# EAGLE design oledSpi (EAGLE 5.08)
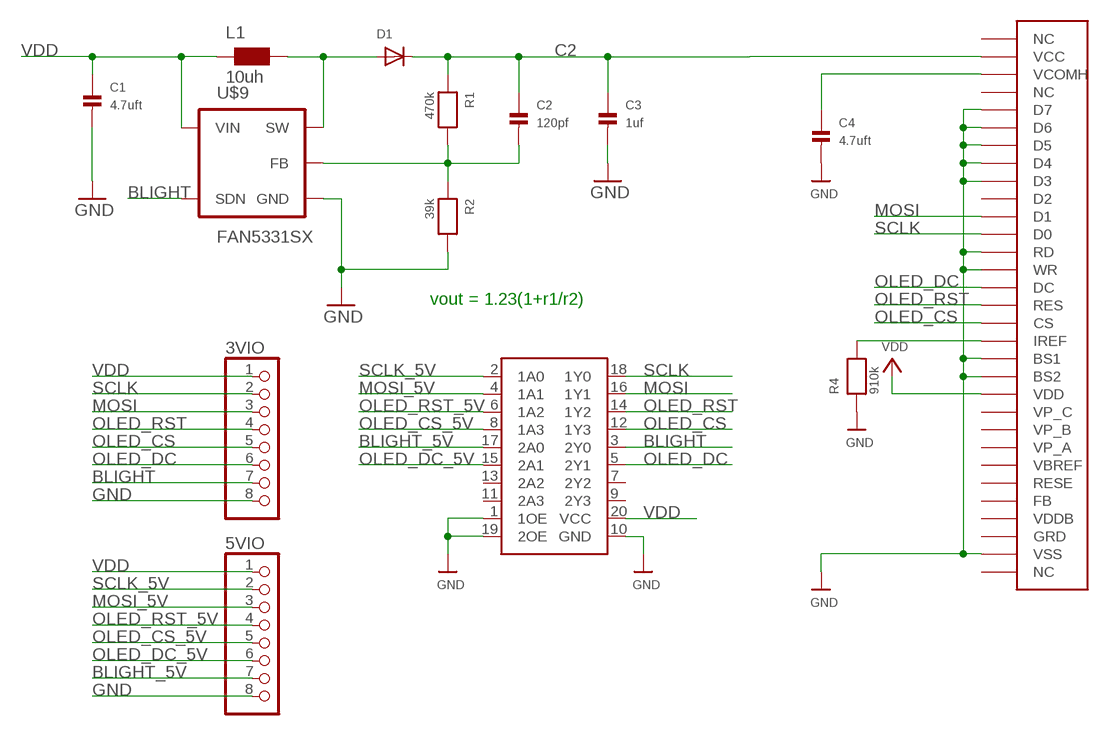
[diagram p0: schematic, sheet 1]

## Parts
3VIO  HEADER-1X8ROUND  [1X08_ROUND]
5VIO  HEADER-1X8ROUND  [1X08_ROUND]
C1  4.7uft  CAP_CERAMIC0805  [0805]
C2  120pf  CAP_CERAMIC0805  [0805]
C3  1uf  CAP_CERAMIC0805  [0805]
C4  4.7uft  CAP_CERAMIC0805  [0805]
D1  DIODESOD-123  [SOD-123]
L1  10uh  WE-KIHQ_1008  [WE-KI_1008_B]
R1  470k  RESISTOR0805  [0805]
R2  39k  RESISTOR0805  [0805]
R4  910k  RESISTOR0805  [0805]
U$1  OLED1040.8MM  [SSD1332OLED_08]
U$2  74LVC244  [TSSOP20]
U$9  FAN5331SX  [SOT23-5]

## Nets
BLIGHT: 3VIO.7 U$2.3(2Y0) U$9.5(SDN)
BLIGHT_5V: 5VIO.7 U$2.17(2A0)
C2 [power]: C2.1 C3.1 D1.C R1.1 U$1.P$2(VCC)
GND [power]: 3VIO.8 5VIO.8 C1.2 C3.2 C4.2 R2.2 R4.1 U$1.P$5(D7) U$1.P$6(D6) U$1.P$7(D5) U$1.P$8(D4) U$1.P$9(D3) U$1.P$13(RD) U$1.P$14(WR) U$1.P$19(BS1) U$1.P$20(BS2) U$1.P$30(VSS) U$2.1(1OE) U$2.10(GND) U$2.19(2OE) U$9.2(GND)
MOSI: 3VIO.3 U$1.P$11(D1) U$2.16(1Y1)
MOSI_5V: 5VIO.3 U$2.4(1A1)
N$1: D1.A L1.1 U$9.1(SW)
N$5: C2.2 R1.2 R2.1 U$9.3(FB)
N$7: C4.1 U$1.P$3(VCOMH)
N$9: R4.2 U$1.P$18(IREF)
OLED_CS: 3VIO.5 U$1.P$17(CS) U$2.12(1Y3)
OLED_CS_5V: 5VIO.5 U$2.8(1A3)
OLED_DC: 3VIO.6 U$1.P$15(DC) U$2.5(2Y1)
OLED_DC_5V: 5VIO.6 U$2.15(2A1)
OLED_RST: 3VIO.4 U$1.P$16(RES) U$2.14(1Y2)
OLED_RST_5V: 5VIO.4 U$2.6(1A2)
SCLK: 3VIO.2 U$1.P$12(D0) U$2.18(1Y0)
SCLK_5V: 5VIO.2 U$2.2(1A0)
VDD [power]: 3VIO.1 5VIO.1 C1.1 L1.2 U$1.P$21(VDD) U$2.20(VCC) U$9.4(VIN)
Unconnected: U$1.P$1(NC) U$1.P$4(NC) U$1.P$10(D2) U$1.P$22(VP_C) U$1.P$23(VP_B) U$1.P$24(VP_A) U$1.P$25(VBREF) U$1.P$26(RESE) U$1.P$27(FB) U$1.P$28(VDDB) U$1.P$29(GRD) U$1.P$31(NC) U$2.7(2Y2) U$2.9(2Y3) U$2.11(2A3) U$2.13(2A2)

## Notes on the sheet
- vout = 1.23(1+r1/r2)

## Library data of the parts
3VIO 5VIO = microbuilder:HEADER-1X8: PIN HEADER
C1 = PeterAtMega644:CAP_CERAMIC: Ceramic Capacitors 0603 - 0603 Surface Mount Capacitors 3pF 250V +/-0.1pF RF Ceramic Capacitor[Digikey: 712-1347-1-ND] 16 pF 50V 5% Ceramic Capacitor[Digikey: 445-5051-2-ND] 18 pF 250V 5% RF Ceramic Capcitor [Digikey: 478-3505-1-ND] 22 pF 50V Ceramic Capacitor [Digikey: PCC220ACVTR-ND] 33 pF 50V 5% Ceramic Capacitor 56 pF 250V 5% C0G RF Ceramic Capcitor [Digikey: 490-4867-1-ND] 680 pF 50V Ceramic Capacitor 2200 pF 50V 5% C0G Ceramic Capacitor [Digikey: 445-1297-1-ND] 5600 pF 100V 5% X7R Ceramic Capacitor [Digikey: 478-3711-1-ND] 0.1 µF 25V 10% Ceramic Capacitor [Digikey: PCC2277TR-ND] 0.22 µF 16V 10% X7R Ceramic Capacitor [Digikey: 445-1318-1-ND] 1.0 µF 25V 10% Ceramic Capacitor [Digikey: 445-5146-2-ND] 0805 - 0805 Surface Mount Capacitors 220 pF 250V 2% RF Ceramic Capacitor [Digikey: 712-1398-1-ND] 1000 pF 50V 2% NP0 Ceramic Capacitor [Digikey: 478-3760-1-ND] 0.1 µF 25V 10% Ceramic Capacitor [Digikey: PCC1828TR-ND] 1.0 µF 16V 10% Ceramic Capacitor[Digikey: 490-1691-2-ND] 10.0 µF 10V 10% Ceramic Capacitor[Digikey: 709-1228-1-ND] 1206 - 1206 Surface Mount Capacitors
C2-C4 = microbuilder:CAP_CERAMIC: Ceramic Capacitors 0603 - 0603 Surface Mount Capacitors 3pF 250V +/-0.1pF RF Ceramic Capacitor[Digikey: 712-1347-1-ND] 16 pF 50V 5% Ceramic Capacitor[Digikey: 445-5051-2-ND] 18 pF 250V 5% RF Ceramic Capcitor [Digikey: 478-3505-1-ND] 22 pF 50V Ceramic Capacitor [Digikey: PCC220ACVTR-ND] 33 pF 50V 5% Ceramic Capacitor 56 pF 250V 5% C0G RF Ceramic Capcitor [Digikey: 490-4867-1-ND] 680 pF 50V Ceramic Capacitor 2200 pF 50V 5% C0G Ceramic Capacitor [Digikey: 445-1297-1-ND] 5600 pF 100V 5% X7R Ceramic Capacitor [Digikey: 478-3711-1-ND] 0.1 µF 25V 10% Ceramic Capacitor [Digikey: PCC2277TR-ND] 0.22 µF 16V 10% X7R Ceramic Capacitor [Digikey: 445-1318-1-ND] 1.0 µF 25V 10% Ceramic Capacitor [Digikey: 445-5146-2-ND] 0805 - 0805 Surface Mount Capacitors 220 pF 250V 2% RF Ceramic Capacitor [Digikey: 712-1398-1-ND] 1000 pF 50V 2% NP0 Ceramic Capacitor [Digikey: 478-3760-1-ND] 0.1 µF 25V 10% Ceramic Capacitor [Digikey: PCC1828TR-ND] 1.0 µF 16V 10% Ceramic Capacitor[Digikey: 490-1691-2-ND] 10.0 µF 10V 10% Ceramic Capacitor[Digikey: 709-1228-1-ND] 1206 - 1206 Surface Mount Capacitors
D1 = microbuilder:DIODE: Diode SMADIODE - SMA Surface Mount Package 20V 1A Schottky Diode Digikey: 641-1014-6-ND SOD-123 30V 500mA (430mV Vf) Schottky Diode - Digikey: B0530W-FDICT-ND SOD-323 10V 570mA (380mV Vf, 3ns) Schottky Diode - Digikey: ZLLS410CT-ND SOD-523 30V 30mA Schottky Diode (RB751S-40TE61) - Digikey: RB751S-40TE61CT-ND SOT23-R/W - SOT23 Package (R = Solder Paste/Reflow Ovens, W = Hand-Soldering) BAT54Film 40V 300mA - Digikey: 497-7162-1-ND DO-1N4148 Through Hole Small Current Diode (any model)
L1 = PeterAtMega644:WE-KIHQ: SMD Wire Wound Ceramic Inductor WE-KIHQ - High current - Highest Quality factor in size 0805 - up to 98 - High thermal stability - High SRF -- Bluetooth -- Wireless LAN -- RF oscillation circuit -- IF impedance matching -- IG choke
R1 R2 R4 = PeterAtMega644:RESISTOR: Resistors 0603 - 0603 Surface Mount Package 0 Ohm 1/10 Watt 1% Resistor 15 Ohm 1/10 Watt 1% Resistor 33 Ohm 1/10 Watt 1% Resistor 49.9 Ohm 1/10 Watt 1% Resistor 100 Ohm 1/10 Watt 1% Resistor 150 Ohm 1/10 Watt 1% Resistor 240 Ohm 1/10 Watt 1% Resistor 390 Ohm 1/10 Watt 1% Resistor 560 Ohm 1/10 Watt 1% Resistor 750 Ohm 1/10 Watt 1% Resistor 1.0K Ohm 1/10 Watt 1% Resistor 1.5K Ohm 1/10 Watt 1% Resistor 2.0K Ohm 1/10 Watt 1% Resistor 10.0K Ohm 1/10 Watt 1% Resistor 20.0K Ohm 1/10 Watt 1% Resistor 33.0K Ohm 1/10 Watt 1% Resistor 100.0K Ohm 1/10 Watt 1% Resistor 0805 - 0805 Surface Mount Package 0 Ohm 1/8 Watt 1% Resistor 33 Ohm 1/8 Watt 1% Resistor 100 Ohm 1/8 Watt 1% Resistor 150 Ohm 1/8 Watt 1% Resistor 200 Ohm 1/8 Watt 1% Resistor 240 Ohm 1/8 Watt 1% Resistor 330 Ohm 1/8 Watt 1% Resistor 390 Ohm 1/8 Watt 1% Resistor 470 Ohm 1/8 Watt 1% Resistor 1.0K Ohm 1/8 Watt 1% Resistor 1.5K Ohm 1/8 Watt 1% Resistor 2.0K Ohm 1/8 Watt 1% Resistor 4.7K Ohm 1/8 Watt 1% Resistor 5.1K Ohm 1/8 Watt 1% Resistor 5.6K Ohm 1/8 Watt 1% Resistor 10.0K Ohm 1/8 Watt 1% Resistor 22.0K Ohm 1/8 Watt 1% Resistor 33.0K Ohm 1/8 Watt 1% Resistor 100K Ohm 1/8 Watt 1% Resistor 1206 - 1206 Surface Mount Package
U$1 = PeterAtMega644:OLED104: LG 1.04 Inch OLED
U$2 = PeterAtMega644:74LVC244
U$9 = PeterAtMega644:FAN5331SX: OLED Supply with 20V Integrated Switch

## Net classes
0 default: width 0.203 mm, drill 0.33 mm, clearance 0.203 mm
1 power: width 0.254 mm, drill 0.33 mm, clearance 0.203 mm

## Board
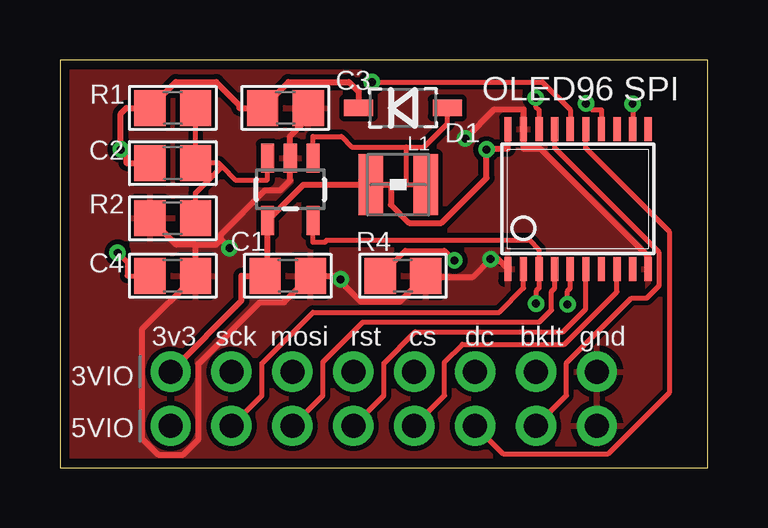
[diagram p1: board, top side]
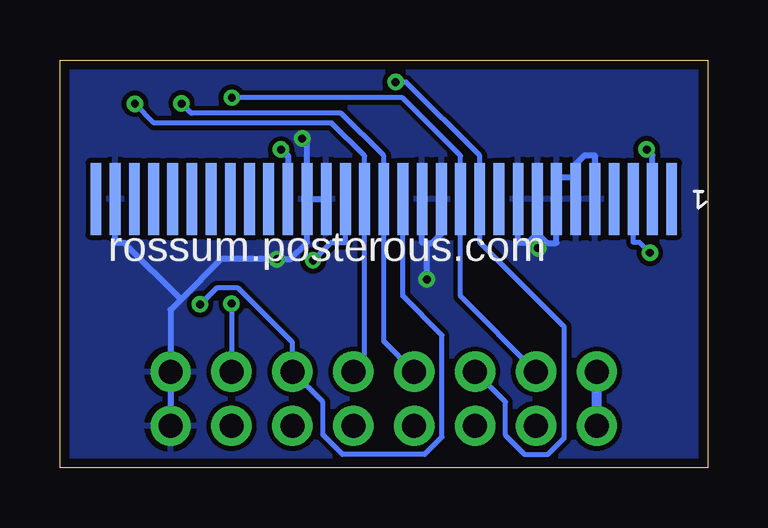
[diagram p2: board, bottom side, seen from below]

Size 27 x 17 mm. Coordinates in mm from the lower left corner, seen from the top.
Outline: 0,0 27,0 27,17 0,17 0,0
Copper layers (1*16): Top 0.0356mm / dielectric 1.5011mm / Bottom 0.0356mm
Design rules "LaenPCBOrder *": minimum track width 6mil, minimum drill 13mil, track to track 6mil, track to pad 6mil, pad to pad 6mil, via to via 6mil, smd to smd 6mil, copper to edge 15mil, drill to drill 6mil, minimum pad ring 7mil, minimum via ring 7mil, stop-mask expansion 4mil, vias tented up to drill 20mil, thermal gap 10mil

### Footprints (pad centres in the part's own frame; a part is rotated, then mirrored left to right if it is on the bottom)
1X08_ROUND = drill 1 pad 1.676 round: 1 -8.89,0; 2 -6.35,0; 3 -3.81,0; 4 -1.27,0; 5 1.27,0; 6 3.81,0; 7 6.35,0; 8 8.89,0
0805 = smd 1.3 x 1.5: 1 -0.95,0; 2 0.95,0
SOD-123 = smd 1.2 x 0.7: A 1.85,0; C -1.85,0
WE-KI_1008_B = smd 1.02 x 2.54: 1 -1.145,0; 2 1.145,0
SSD1332OLED_08 = smd 0.45 x 3: P$1 -12,0; P$2 -11.2,0; P$3 -10.4,0; P$4 -9.6,0; P$5 -8.8,0; P$6 -8,0; P$7 -7.2,0; P$8 -6.4,0; P$9 -5.6,0; P$10 -4.8,0; P$11 -4,0; P$12 -3.2,0; P$13 -2.4,0; P$14 -1.6,0; P$15 -0.8,0; P$16 0,0; P$17 0.8,0; P$18 1.6,0; P$19 2.4,0; P$20 3.2,0; P$21 4,0; P$22 4.8,0; P$23 5.6,0; P$24 6.4,0; P$25 7.2,0; P$26 8,0; P$27 8.8,0; P$28 9.6,0; P$29 10.4,0; P$30 11.2,0; P$31 12,0
TSSOP20 = smd 0.305 x 0.991: 1 -2.925,-2.918; 2 -2.275,-2.918; 3 -1.625,-2.918; 4 -0.975,-2.918; 5 -0.325,-2.918; 6 0.325,-2.918; 7 0.975,-2.918; 8 1.625,-2.918; 9 2.275,-2.918; 10 2.925,-2.918; 11 2.925,2.918; 12 2.275,2.918; 13 1.625,2.918; 14 0.975,2.918; 15 0.325,2.918; 16 -0.325,2.918; 17 -0.975,2.918; 18 -1.625,2.918; 19 -2.275,2.918; 20 -2.925,2.918
SOT23-5 = smd 0.55 x 1.2: 1 -0.95,-1.3; 2 0,-1.3; 3 0.95,-1.3; 4 0.95,1.3; 5 -0.95,1.3

### Placement (x,y rotation side)
3VIO  13.5,4 0 top
5VIO  13.5,1.74 0 top
C1  9.5,8 0 top
C2  4.7,12.7 0 top
C3  9.4,15 0 top
C4  4.7,8 0 top
D1  14.3,15 0 top
L1  14.1,11.8 180 top
R1  4.7,15 0 top
R2  4.7,10.4 180 top
R4  14.3,8 180 top
U$1  13.5,11.2 180 bottom
U$2  21.6,11.2 0 top
U$9  9.6,11.6 180 top

### Tracks (layer width: path | path; a pad name or v marks a point on that pad's centre or on a via)
BLIGHT  (via drill 0.33 pad 0.69)
  Top 0.203: U$9.5 10.55,9.39 11.04,9.39 11.13,9.49 19.57,9.49 19.98,9.08 U$2.3 19.98,7.48 19.85,7.36 v19.85,6.84
  Bottom 0.203: v19.85,6.84 3VIO.7
BLIGHT_5V
  Top 0.203: U$2.17 20.62,13.32 24.98,8.96 24.98,7.59 24.46,7.07 23.82,7.07 21.12,4.37 21.12,3.01 5VIO.7
C2  (via drill 0.33 pad 0.69)
  Top 0.254: C2.1 2.77,12.7 2.77,13.04 v2.54,13.27 2.54,14.77 2.77,15 R1.1 4.83,16.08 6.51,16.08 7.47,15.12 7.47,15 C3.1 9.53,16.08 12.05,16.08 12.45,15.68 D1.C
  Bottom 0.254: U$1.P$2 2.3,13.03 v2.54,13.27
GND  (via drill 0.33 pad 0.69)
  Top 0.254: 6.71,9.51 v7.07,9.15 | 6.71,9.51 6.71,9.71 8.56,11.56 9.19,11.56 9.6,11.97 U$9.2 9.6,13.83 10.35,14.58 C3.2 | v16.91,13.72 18.12,14.94 19.32,14.94 U$2.19 19.32,13.29 20.04,13.29 24.52,8.81 U$2.10 | 5.65,9.3 6.5,9.3 6.71,9.51 | R2.2 4.85,9.3 5.65,9.3 | 5.65,9.3 5.65,9.08 5.65,8.11 C4.2 3.43,5.78 3.43,1.2 4.1,0.54 5.13,0.54 5.78,1.19 5.78,4.33 8.35,6.9 9.35,6.9 C1.2 11.43,8 11.59,7.84 v11.7,7.84 11.7,7.76 12.54,6.92 14.17,6.92 R4.1 15.29,7.96 17.22,7.96 v17.96,8.69 18.27,8.69 U$2.1
  Bottom 0.254: U$1.P$20 16.7,13.52 v16.91,13.72 | 11.7,9.37 11.9,9.37 U$1.P$14 | v11.7,7.84 11.7,9.37 | 11.7,9.37 11.48,9.37 11.1,9.75 11.1,10.29 U$1.P$13 | 7.1,10.29 7.1,9.77 6.7,9.37 6.3,9.37 U$1.P$7 6.3,12.12 5.5,12.12 | 7.1,10.29 7.1,10.74 U$1.P$8 | U$1.P$9 7.9,9.37 7.48,9.37 7.1,9.75 7.1,10.29 | 7.1,10.29 7.1,9.37 7.1,9.18 v7.07,9.15 | U$1.P$20 U$1.P$19 | U$1.P$5 4.7,13.03 5.12,13.03 5.5,12.65 5.5,12.12 | 5.5,12.12 U$1.P$6 | 5VIO.8 3VIO.8 22.39,6.57 21.96,7.01 | U$1.P$30 24.7,9.37 24.32,9.37 21.96,7.01 | 21.96,7.01 20.27,8.69 v17.96,8.69 17.38,8.69 16.7,9.37 U$1.P$20
  pour Bottom: 0,0 27.2,0 27.2,16.8 0,16.8
  pour Top: 0,0 27.2,0 27.2,16.8 0,16.8
MOSI  (via drill 0.33 pad 0.69)
  Top 0.203: v13.01,16.07 20.12,16.07 21.27,14.92 U$2.16
  Bottom 0.203: v13.01,16.07 12.57,16.07 9.5,13.01 U$1.P$11 9.5,9.39 5.97,5.87 5.97,1.24 6.67,0.54 7.62,0.54 8.42,1.34 8.42,2.73 3VIO.3
MOSI_5V
  Top 0.203: U$2.4 20.62,7.48 20.5,7.35 20.5,6.57 19.99,6.06 12.62,6.06 10.96,4.4 10.96,3.01 5VIO.3
N$1
  Top 0.203: 14.43,13.38 12.16,13.38 11.73,13.8 10.55,13.8 U$9.1 | 14.43,13.38 15.18,13.38 16.15,14.35 D1.A | 14.43,13.38 14.43,11.8 L1.1
N$5
  Top 0.203: 6.75,12.55 6.61,12.7 C2.2 R1.2 | 6.75,12.55 7.31,11.99 8.65,11.99 U$9.3 | 6.75,12.55 5.65,11.46 R2.1
N$7  (via drill 0.33 pad 0.69)
  Top 0.203: C4.1 2.79,8 2.79,8.56 v2.4,8.96
  Bottom 0.203: U$1.P$3 3.1,9.39 2.84,9.39 v2.4,8.96
N$9  (via drill 0.33 pad 0.69)
  Top 0.203: v16.45,8.64 16.03,9.05 14.4,9.05 R4.2
  Bottom 0.203: U$1.P$18 15.1,9.39 15.69,9.39 v16.45,8.64
OLED_CS  (via drill 0.33 pad 0.69)
  Top 0.203: v23.88,15.17 U$2.12
  Bottom 0.203: v23.88,15.17 23.07,14.37 15.67,14.37 14.3,13.01 U$1.P$17 14.3,4.47 3VIO.5
OLED_CS_5V
  Top 0.203: 5VIO.5 16.04,3.01 16.04,4.41 16.77,5.14 21.04,5.14 23.23,7.33 U$2.8
OLED_DC  (via drill 0.33 pad 0.69)
  Top 0.203: v21.16,6.81 21.16,7.36 21.27,7.48 U$2.5
  Bottom 0.203: v21.16,6.81 20.48,7.49 19.58,7.49 17.31,5.22 3VIO.6 16.04,2.73 16.04,1.37 15.22,0.55 11.79,0.55 11.06,1.28 11.06,5.51 12.7,7.15 U$1.P$15
OLED_DC_5V
  Top 0.203: U$2.15 21.93,13.32 25.42,9.82 25.42,3.14 22.86,0.58 18.47,0.58 5VIO.6
OLED_RST  (via drill 0.33 pad 0.69)
  Top 0.203: v21.93,15.19 22.2,14.92 22.57,14.92 U$2.14
  Bottom 0.203: v21.93,15.19 21.52,14.78 15.27,14.78 13.5,13.01 U$1.P$16 13.5,5.27 3VIO.4
OLED_RST_5V
  Top 0.203: U$2.6 21.93,6.6 20.98,5.66 14.8,5.66 13.5,4.35 13.5,3.01 5VIO.4
SCLK  (via drill 0.33 pad 0.69)
  Top 0.203: v19.83,15.43 19.83,15.06 19.98,14.92 U$2.18
  Bottom 0.203: v19.83,15.43 12.72,15.43 10.3,13.01 U$1.P$12 10.3,7.15 3VIO.2
SCLK_5V
  Top 0.203: U$2.2 19.32,7.48 18.31,6.47 10.54,6.47 8.42,4.35 8.42,3.01 5VIO.2
VDD  (via drill 0.33 pad 0.69)
  Top 0.254: 8.06,8 8.65,8.59 U$9.4 10.15,11.8 L1.2 13.79,11.8 13.79,10.96 14.55,10.2 15.91,10.2 17.79,12.08 v17.79,13.27 17.81,13.29 18.68,13.29 U$2.20 | 8.06,8 7.57,8 7.57,6.96 3VIO.1 | 8.06,8 C1.1
  Bottom 0.254: U$1.P$21 17.5,13.03 17.55,13.03 v17.79,13.27
  Bottom 0.406: 5VIO.1 3VIO.1

### Text on the board
tPlace: OLED96 SPI | 3v3 | sck | mosi | rst | cs | dc | bklt | gnd
bPlace: rossum.posterous.com